# EAGLE design wbz451pe (EAGLE 9.6.2)
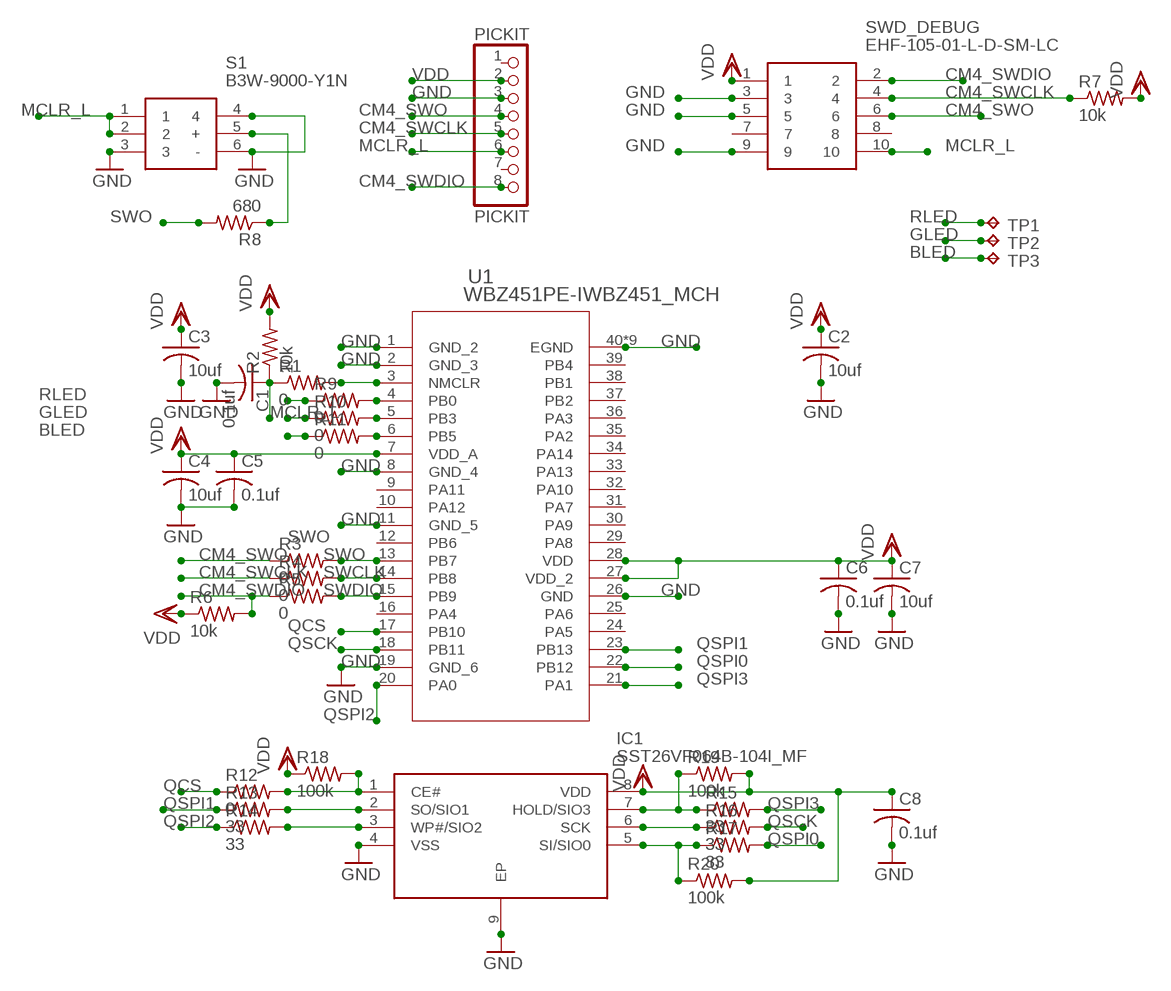
[diagram p0: schematic, sheet 1]

## Parts
C1  0.1uf  C-USC0805  [C0805]
C2  10uf  C-USC0805  [C0805]
C3  10uf  C-USC0805  [C0805]
C4  10uf  C-USC0805  [C0805]
C5  0.1uf  C-USC0805  [C0805]
C6  0.1uf  C-USC0805  [C0805]
C7  10uf  C-USC0805  [C0805]
C8  0.1uf  C-USC0805  [C0805]
IC1  SST26VF064B-104I_MF  [SON127P600X500X80-9N]
PICKIT  PICKIT  PINHD-1X8  [1X08]
R1  0  R-US_M0805  [M0805]
R2  10k  R-US_M0805  [M0805]
R3  0  R-US_M0805  [M0805]
R4  0  R-US_M0805  [M0805]
R5  0  R-US_M0805  [M0805]
R6  10k  R-US_M0805  [M0805]
R7  10k  R-US_M0805  [M0805]
R8  680  R-US_M0805  [M0805]
R9  0  R-US_M0805  [M0805]
R10  0  R-US_M0805  [M0805]
R11  0  R-US_M0805  [M0805]
R12  0  R-US_R0603  [R0603]
R13  33  R-US_R0603  [R0603]
R14  33  R-US_R0603  [R0603]
R15  33  R-US_R0603  [R0603]
R16  33  R-US_R0603  [R0603]
R17  33  R-US_R0603  [R0603]
R18  100k  R-US_R0603  [R0603]
R19  100k  R-US_R0603  [R0603]
R20  100k  R-US_R0603  [R0603]
S1  B3W-9000-Y1N  [B3W-9_1-LED]
SWD_DEBUG  EHF-105-01-L-D-SM-LC  [EHF-105-01-XX-D-SM-LC]
TP1  TPPAD1-13  [P1-13]
TP2  TPPAD1-13  [P1-13]
TP3  TPPAD1-13  [P1-13]
U1  WBZ451PE-IWBZ451_MCH  [WBZ451_MCH]

## Nets
BLED: R11.1 TP3.TP
CM4_SWCLK: PICKIT.5 R4.1 R7.1 SWD_DEBUG.4
CM4_SWDIO: PICKIT.8 R5.1 R6.2 SWD_DEBUG.2
CM4_SWO: PICKIT.4 R3.1 SWD_DEBUG.6
GLED: R10.1 TP2.TP
GND: C1.2 C2.2 C3.2 C4.2 C5.2 C6.2 C7.2 C8.2 IC1.4(VSS) IC1.9(EP) PICKIT.3 S1.3 S1.4 S1.6(-) SWD_DEBUG.3 SWD_DEBUG.5 SWD_DEBUG.9 U1.1(GND_2) U1.2(GND_3) U1.8(GND_4) U1.11(GND_5) U1.19(GND_6) U1.26(GND) U1.40(EGND) U1.41(EGND) U1.42(EGND) U1.43(EGND) U1.44(EGND) U1.45(EGND) U1.46(EGND) U1.47(EGND) U1.48(EGND)
MCLR_L: C1.1 PICKIT.6 R1.1 R2.1 S1.1 S1.2 SWD_DEBUG.10
N$1: R1.2 U1.3(NMCLR)
N$2: R9.2 U1.4(PB0)
N$3: R8.1 S1.5(+)
N$4: R10.2 U1.5(PB3)
N$5: R11.2 U1.6(PB5)
N$6: IC1.1(CE#) R12.2 R18.2
N$7: IC1.2(SO/SIO1) R13.2
N$8: IC1.3(WP#/SIO2) R14.2
N$9: IC1.7(HOLD/SIO3) R15.1 R19.1
N$10: IC1.6(SCK) R16.1
N$11: IC1.5(SI/SIO0) R17.1 R20.1
QCS: R12.1 U1.17(PB10)
QSCK: R16.2 U1.18(PB11)
QSPI0: R17.2 U1.22(PB12)
QSPI1: R13.1 U1.23(PB13)
QSPI2: R14.1 U1.20(PA0)
QSPI3: R15.2 U1.21(PA1)
RLED: R9.1 TP1.TP
SWCLK: R4.2 U1.14(PB8)
SWDIO: R5.2 U1.15(PB9)
SWO: R3.2 R8.2 U1.13(PB7)
VDD: C2.1 C3.1 C4.1 C5.1 C6.1 C7.1 C8.1 IC1.8(VDD) PICKIT.2 R2.2 R6.1 R7.2 R18.1 R19.2 R20.2 SWD_DEBUG.1 U1.7(VDD_A) U1.27(VDD_2) U1.28(VDD)
Unconnected: PICKIT.1 PICKIT.7 SWD_DEBUG.7 SWD_DEBUG.8 U1.9(PA11) U1.10(PA12) U1.12(PB6) U1.16(PA4) U1.24(PA5) U1.25(PA6) U1.29(PA8) U1.30(PA9) U1.31(PA7) U1.32(PA10) U1.33(PA13) U1.34(PA14) U1.35(PA2) U1.36(PA3) U1.37(PB2) U1.38(PB1) U1.39(PB4)

## Library data of the parts
C1-C8 = rcl:C-US: CAPACITOR, American symbol; SPICEPREFIX: C
IC1 = SST26VF064B-104I_MF:SST26VF064B-104I_MF: SST26VF064B-104I/MF, SPI Split Gate Flash Memory, 8M x 8 bit 64Mbit, 3ns, 2.7 3.6 V, 8-Pin, WDFN Source: Datasheet <http://www.microchip.com/mymicrochip/filehandler.aspx?ddocname=en561262>; DESCRIPTION: SST26VF064B-104I/MF, SPI Split Gate Flash Memory, 8M x 8 bit 64Mbit, 3ns, 2.7 3.6 V, 8-Pin, WDFN; HEIGHT: 0.8mm; MANUFACTURER_NAME: Microchip; MANUFACTURER_PART_NUMBER: SST26VF064B-104I/MF; MOUSER_PART_NUMBER: 579-ST26VF064B104IMF; MOUSER_PRICE-STOCK: https://www.mouser.co.uk/ProductDetail/Microchip-Technology-Atmel/SST26VF064B-104I-MF?qs=wzzOUr4NhYqR1%252B6K2JaweQ%3D%3D
PICKIT = pinhead:PINHD-1X8: PIN HEADER
R1-R20 = rcl:R-US_: RESISTOR, American symbol; SPICEPREFIX: R
S1 = SamacSys_Parts:B3W-9000-Y1N: Illuminated Tactile Switches Illuminated Ylw LED White Cap Source: Datasheet <http://www.mouser.com/ds/2/307/en-b3w-9-11824.pdf>; ALLIED_NUMBER: 70176005; ALLIED_PRICE-STOCK: https://www.alliedelec.com/omron-electronic-components-b3w-9000-y1n/70176005/; DESCRIPTION: Illuminated Tactile Switches Illuminated Ylw LED White Cap; HEIGHT: mm; MANUFACTURER_NAME: Omron Electronics; MANUFACTURER_PART_NUMBER: B3W-9000-Y1N; MOUSER_PART_NUMBER: 653-B3W-9000-Y1N; MOUSER_PRICE-STOCK: https://www.mouser.com/Search/Refine.aspx?Keyword=653-B3W-9000-Y1N; RS_PART_NUMBER: 0492777P; RS_PRICE-STOCK: http://uk.rs-online.com/web/p/products/0492777P
SWD_DEBUG = EHF-105-01-L-D-SM-LC:EHF-105-01-L-D-SM-LC: 10 Position, .050" Shrouded IDC Header with Ejectors Source: Datasheet <http://suddendocs.samtec.com/prints/ehf-1xx-01-x-d-xx-xx-xx-mkt.pdf>; DESCRIPTION: 10 Position, .050&quot; Shrouded IDC Header with Ejectors; HEIGHT: mm; MANUFACTURER_NAME: SAMTEC; MANUFACTURER_PART_NUMBER: EHF-105-01-L-D-SM-LC; MOUSER_PART_NUMBER: 200-EHF10501LDSMLC; MOUSER_PRICE-STOCK: https://www.mouser.co.uk/ProductDetail/Samtec/EHF-105-01-L-D-SM-LC?qs=iT52DjcXudvuSMtK3643sA%3D%3D
TP1-TP3 = testpad:TP: Test pad
U1 = 2024-05-29_22-27-45_Library:WBZ451PE-I; COPYRIGHT: Copyright (C) 2024 Ultra Librarian. All rights reserved.; MANUFACTURER_PART_NUMBER: WBZ451PE-I; MFR_NAME: Microchip

## Board
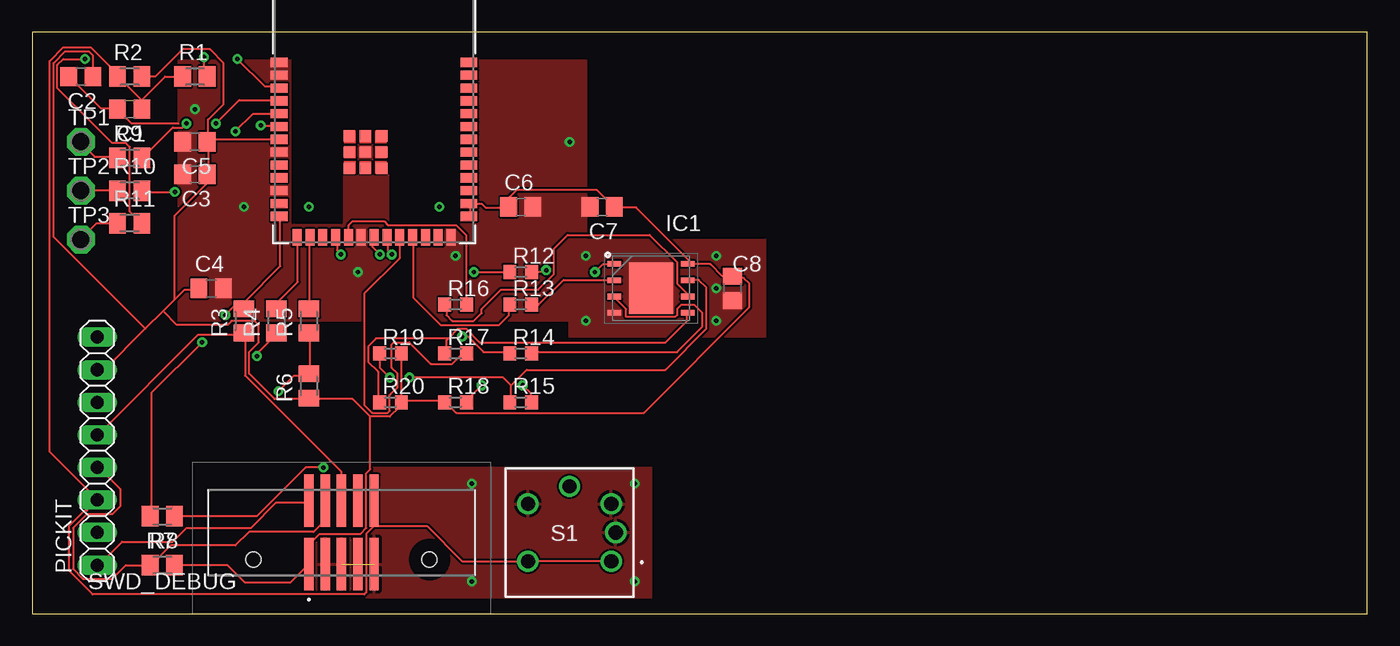
[diagram p1: board, top side]
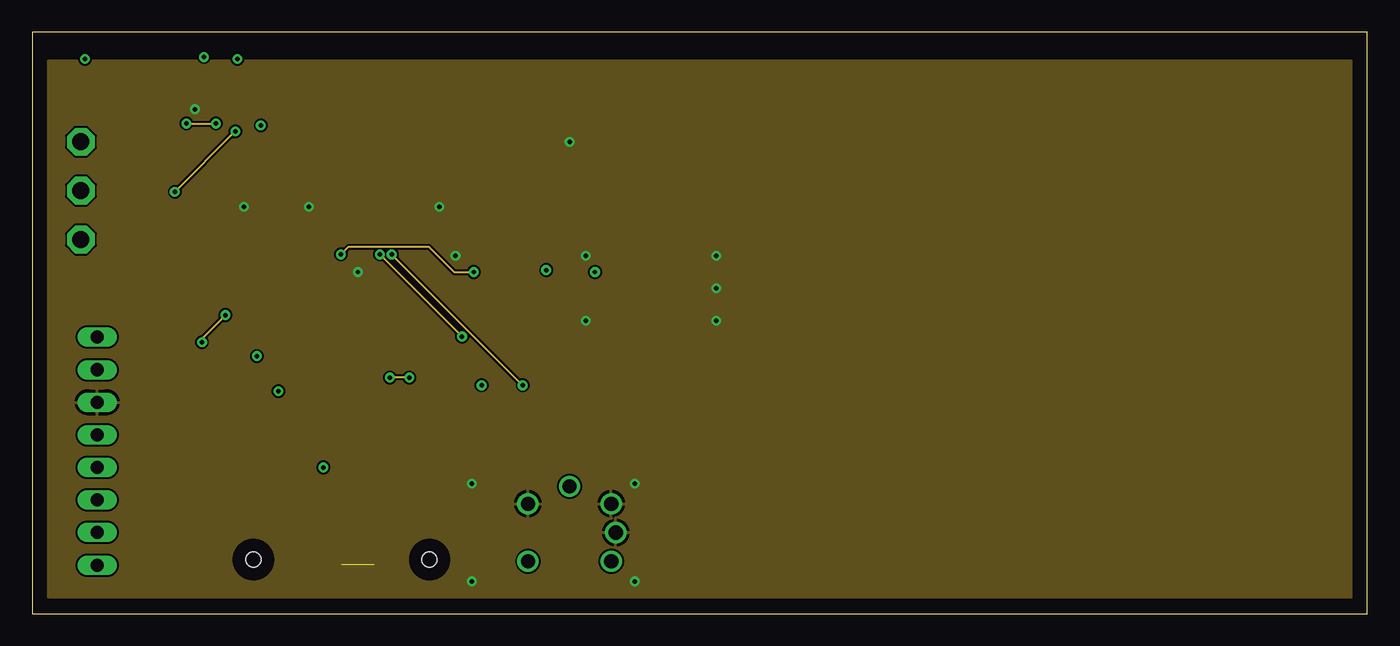
[diagram p2: board, inner layer Route2]
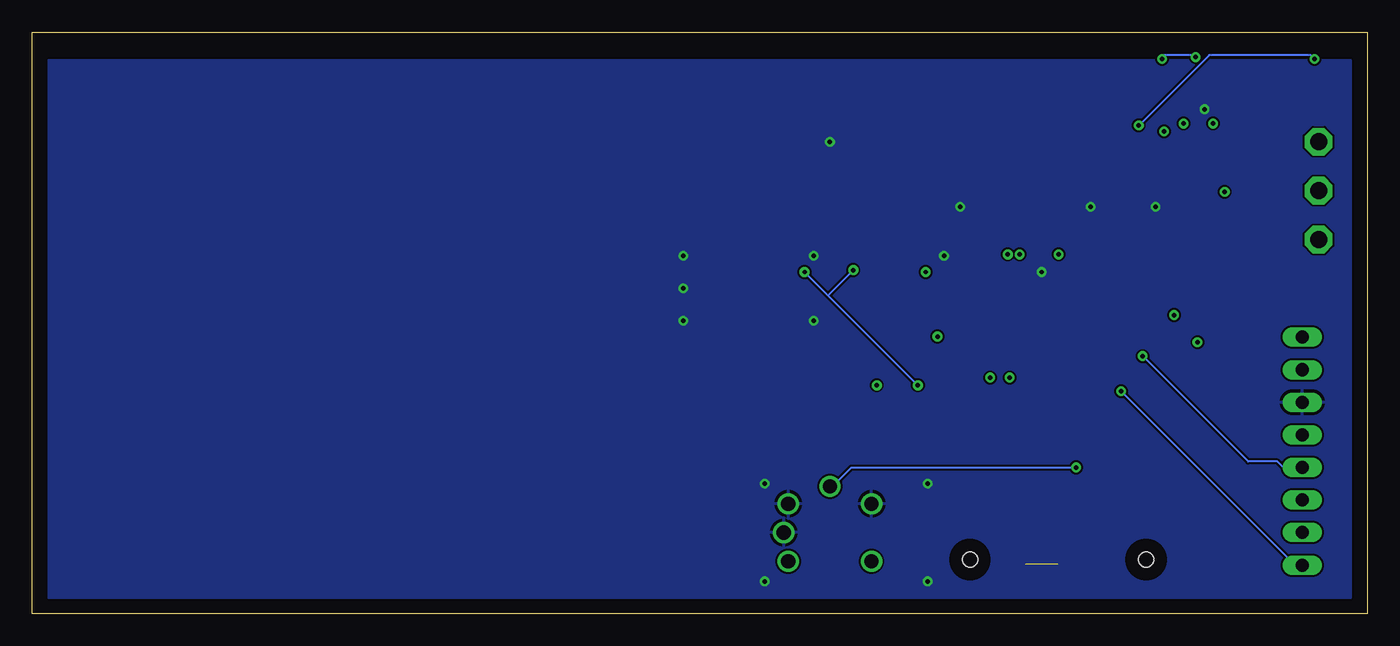
[diagram p3: board, bottom side, seen from below]

Size 104.12 x 45.39 mm. Coordinates in mm from the lower left corner, seen from the top.
Outline: 0,0 104.12,0 104.12,45.39 0,45.39 0,0
Copper layers (1+2*15+16): Top 0.035mm / dielectric 1.5mm / Route2 0.035mm / dielectric 0.15mm / Route15 0.035mm / dielectric 0.2mm / Bottom 0.035mm
Design rules "default *": minimum track width 6mil, minimum drill 0.35mm, track to track 6mil, track to pad 6mil, pad to pad 6mil, via to via 6mil, smd to smd 6mil, copper to edge 40mil, drill to drill 6mil, minimum pad ring 10mil, minimum via ring 8mil, stop-mask expansion 4mil, vias tented up to drill 0mil, thermal gap 10mil
tRestrict: area 27.9,30.5 to 33,44.5; area 20.3,30.5 to 24.1,44.5

### Footprints (pad centres in the part's own frame; a part is rotated, then mirrored left to right if it is on the bottom)
C0805 = smd 1.3 x 1.5: 1 -0.95,0; 2 0.95,0
SON127P600X500X80-9N = smd 1.05 x 0.45: 1 -2.85,1.905; 2 -2.85,0.635; 3 -2.85,-0.635; 4 -2.85,-1.905; 5 2.85,-1.905; 6 2.85,-0.635; 7 2.85,0.635; 8 2.85,1.905 | smd 3.4 x 4: 9 0,0
1X08 = drill 1.016 long: 1 -8.89,0; 2 -6.35,0; 3 -3.81,0; 4 -1.27,0; 5 1.27,0; 6 3.81,0; 7 6.35,0; 8 8.89,0
M0805 = smd 1.3 x 1.6: 1 -0.95,0; 2 0.95,0
R0603 = smd 1 x 1.1: 1 -0.85,0; 2 0.85,0
B3W-9_1-LED = drill 1.1 pad 1.65: 1 3.25,-2.25; 2 -3.25,-2.25; 3 3.25,2.25; 4 -3.25,2.25; 5 0,3.6; 6 3.6,0
EHF-105-01-XX-D-SM-LC = smd 0.74 x 4.09: 1 -2.54,-2.475; 2 -2.54,2.475; 3 -1.27,-2.475; 4 -1.27,2.475; 5 0,-2.475; 6 0,2.475; 7 1.27,-2.475; 8 1.27,2.475; 9 2.54,-2.475; 10 2.54,2.475 | hole 1.19: -6.86,-2.11; 6.86,-2.11
P1-13 = drill 1.321 pad 2.159 octagon: TP 0,0
WBZ451_MCH = smd 1.295 x 0.711: 1 -7.4,3.65; 2 -7.4,2.65; 3 -7.4,1.65; 4 -7.4,0.65; 5 -7.4,-0.35; 6 -7.4,-1.35; 7 -7.4,-2.35; 8 -7.4,-3.35; 9 -7.4,-4.35; 10 -7.4,-5.35; 11 -7.4,-6.35; 12 -7.4,-7.35; 13 -7.4,-8.35; 27 7.4,-8.35; 28 7.4,-7.35; 29 7.4,-6.35; 30 7.4,-5.35; 31 7.4,-4.35; 32 7.4,-3.35; 33 7.4,-2.35; 34 7.4,-1.35; 35 7.4,-0.35; 36 7.4,0.65; 37 7.4,1.65; 38 7.4,2.65; 39 7.4,3.65 | smd 0.711 x 1.295: 14 -6,-10; 15 -5,-10; 16 -4,-10; 17 -3,-10; 18 -2,-10; 19 -1,-10; 20 0,-10; 21 1,-10; 22 2,-10; 23 3,-10; 24 4,-10; 25 5,-10; 26 6,-10 | smd 0.889 x 0.889: 40 -0.68,-3.35; 41 -1.95,-2.08; 42 -0.68,-2.08; 43 0.59,-2.08; 44 0.59,-3.35; 45 0.59,-4.62; 46 -0.68,-4.62; 47 -1.95,-3.35; 48 -1.95,-4.62

### Placement (x,y rotation side)
C1  7.62,39.37 180 top
C2  3.81,41.91 180 top
C3  12.7,34.29 180 top
C4  13.97,25.4 0 top
C5  12.7,36.83 180 top
C6  38.1,31.75 0 top
C7  44.45,31.75 180 top
C8  54.61,25.4 270 top
IC1  48.26,25.4 0 top
PICKIT  5.08,12.7 270 top
R1  12.7,41.91 0 top
R2  7.62,41.91 0 top
R3  16.51,22.86 90 top
R4  19.05,22.86 90 top
R5  21.59,22.86 90 top
R6  21.59,17.78 90 top
R7  10.16,3.81 0 top
R8  10.16,7.62 180 top
R9  7.62,35.56 0 top
R10  7.62,33.02 0 top
R11  7.62,30.48 0 top
R12  38.1,26.67 0 top
R13  38.1,24.13 0 top
R14  38.1,20.32 0 top
R15  38.1,16.51 0 top
R16  33.02,24.13 0 top
R17  33.02,20.32 0 top
R18  33.02,16.51 0 top
R19  27.94,20.32 0 top
R20  27.94,16.51 0 top
S1  41.91,6.35 0 top
SWD_DEBUG  24.13,6.35 0 top
TP1  3.81,36.83 0 top
TP2  3.81,33.02 0 top
TP3  3.81,29.21 0 top
U1  26.67,39.37 0 top

### Tracks (layer width: path | path; a pad name or v marks a point on that pad's centre or on a via)
BLED
  Top 0.152: R11.1 5.03,30.48 3.81,29.26 TP3.TP
CM4_SWCLK  (via drill 0.35)
  Top 0.152: SWD_DEBUG.4 22.86,7.32 21.95,6.4 16.92,6.4 15.85,5.33 10.82,5.33 9.3,3.81 R7.1 7.32,3.81 6.25,2.74 3.96,2.74 3.2,3.5 3.2,6.71 4.27,7.77 6.25,7.77 6.86,8.38 6.86,9.75 5.18,11.43 PICKIT.5 | v17.53,20.12 17.53,20.27 19.05,21.79 R4.1
  Bottom 0.152: v17.53,20.12 9.3,11.89 7.01,11.89 6.55,11.43 PICKIT.5
CM4_SWDIO  (via drill 0.35)
  Top 0.152: R5.1 21.64,21.79 21.64,18.75 R6.2 21.49,18.59 20.42,18.59 v19.2,17.37 | SWD_DEBUG.2 21.49,8.69 19.05,8.69 17.07,6.71 12.04,6.71 10.97,5.64 7.01,5.64 5.18,3.81 PICKIT.8
  Bottom 0.152: v19.2,17.37 5.64,3.81 PICKIT.8
CM4_SWO
  Top 0.152: PICKIT.4 5.18,14.02 12.95,21.79 16.46,21.79 R3.1 16.61,21.79 16.61,18.59 24.08,11.12 24.08,8.84 SWD_DEBUG.6
GLED
  Top 0.152: R10.1 6.55,33.07 3.81,33.07 TP2.TP
GND  (via drill 0.35)  (1 unrouted)
  Top 0.152: C2.2 2.9,41.91 5.33,39.47 6.55,39.47 C1.2 6.71,39.32 7.77,38.25 11.43,38.25
  other vias: 31.75,31.75 21.59,31.75 41.91,36.83 25.4,26.67 34.29,10.16 34.29,2.54 46.99,10.16 46.99,2.54 53.34,27.94 53.34,22.86 43.18,27.94 43.18,22.86 53.34,25.4 33.02,27.94 16.51,31.75 12.7,39.37
  pour Top (no thermals): 11.43,43.18 43.18,43.18 43.18,22.86 12.7,22.86 11.43,22.86
  pour Route2: 1.27,43.18 102.87,43.18 102.87,1.27 1.27,1.27
  pour Bottom: 1.27,43.18 102.87,43.18 102.87,1.27 1.27,1.27
  pour Top: 12.7,11.43 48.26,11.43 48.26,1.27 12.7,1.27
  pour Top (no thermals): 41.91,29.21 57.15,29.21 57.15,21.59 41.91,21.59
MCLR_L
  Top 0.152: S1.1 45.11,4.12 38.71,4.12 S1.2 38.56,4.12 33.53,4.12 30.79,6.86 26.67,6.86 | 8.53,40.08 8.53,39.47 C1.1 8.53,40.08 | 8.53,40.08 6.71,41.91 R2.1 6.55,41.91 6.55,42.22 4.57,44.2 2.44,44.2 1.37,43.13 1.37,12.65 5.03,8.99 PICKIT.6 4.27,8.08 4.12,8.08 2.9,6.86 2.9,3.35 4.72,1.52 25.91,1.52 26.06,1.68 26.06,6.25 26.67,6.86 | R1.1 10.36,41.91 8.53,40.08 | SWD_DEBUG.10 26.67,6.86
N$1  (via drill 0.35)
  Top 0.152: v16,43.28 18.14,41.15 19.2,41.15 U1.3 | v13.41,43.43 13.41,42.06 13.56,41.91 R1.2
  Bottom 0.152: v16,43.28 16,43.43 15.85,43.59 13.56,43.59 v13.41,43.43
N$2  (via drill 0.35)
  Top 0.152: v14.33,38.25 16.15,40.08 19.2,40.08 U1.4 | v12.04,38.25 11.73,37.95 10.97,37.95 8.69,35.66 R9.2
  Route2 0.152: v12.04,38.25 v14.33,38.25
N$3  (via drill 0.35)
  Top 0.152: R8.1 17.53,7.62 21.34,11.43 v22.71,11.43
  Bottom 0.152: v22.71,11.43 40.23,11.43 41.6,10.06 41.91,10.06 S1.5
N$4  (via drill 0.35)
  Top 0.152: v15.85,37.64 17.22,39.01 19.2,39.01 U1.5 | v11.12,32.92 8.69,32.92 R10.2
  Route2 0.152: v11.12,32.92 v15.85,37.64
N$5  (via drill 0.35)
  Top 0.152: v17.83,38.1 19.2,38.1 U1.6 | v4.12,43.28 2.44,43.28 1.98,42.82 1.98,41 6.25,36.73 7.32,36.73 7.62,36.42 7.62,31.39 8.53,30.48 R11.2
  Bottom 0.152: v17.83,38.1 12.34,43.59 4.42,43.59 v4.12,43.28
N$6  (via drill 0.35)
  Top 0.152: v43.89,26.67 44.5,27.28 45.26,27.28 IC1.1 | v35.05,17.83 33.83,16.61 R18.2 | R12.2 39.93,26.67 v40.08,26.82
  Bottom 0.152: v35.05,17.83 42.06,24.84 | 42.06,24.84 v43.89,26.67 | 42.06,24.84 v40.08,26.82
N$7
  Top 0.152: IC1.2 45.26,26.06 41.45,26.06 39.47,24.08 39.01,24.08 R13.2
N$8
  Top 0.152: IC1.3 45.41,24.69 46.33,23.77 46.33,23.16 50.14,23.16 50.29,23.32 50.29,23.77 50.6,24.08 51.66,24.08 52.27,23.47 52.27,22.4 50.29,20.42 39.01,20.42 R14.2
N$9  (via drill 0.35)
  Top 0.152: 37.34,17.83 38.56,19.05 49.38,19.05 52.58,22.25 52.58,25.45 51.97,26.06 51.21,26.06 IC1.7 | 37.34,17.83 37.34,16.61 R15.1 | v27.89,18.44 27.13,19.2 27.13,20.27 R19.1 | v29.41,18.44 36.73,18.44 37.34,17.83
  Route2 0.152: v29.41,18.44 v27.89,18.44
N$10
  Top 0.152: IC1.6 51.05,24.84 51.05,24.99 50.29,25.76 50.29,27.43 48.16,29.57 41.76,29.57 40.69,28.5 40.69,26.52 39.47,25.3 36.58,25.3 35.05,23.77 35.05,23.47 34.44,22.86 32.77,22.86 32.31,23.32 32.31,24.08 R16.1
N$11
  Top 0.152: 32.46,21.49 32.31,21.34 32.31,20.42 R17.1 | 32.46,21.49 33.22,22.25 33.83,22.25 34.9,21.18 49.38,21.18 51.05,22.86 51.05,23.47 IC1.5 | 32.46,21.49 26.82,21.49 26.21,20.88 26.21,19.66 26.98,18.9 26.98,16.61 R20.1
QCS  (via drill 0.35)
  Top 0.152: v34.44,26.67 R12.1 | v24.08,28.04 23.77,28.35 23.77,29.26 U1.17
  Route2 0.152: v34.44,26.67 32.92,26.67 30.94,28.65 24.69,28.65 v24.08,28.04
QSCK
  Top 0.152: R16.2 33.83,24.23 33.83,29.57 33.07,30.33 27.74,30.33 27.43,30.63 24.99,30.63 24.69,30.33 24.69,29.41 U1.18
QSPI0
  Top 0.152: R17.2 33.83,20.27 33.53,20.27 32.77,19.51 31.09,19.51 29.41,21.18 28.19,21.18 28.04,21.03 28.04,19.2 28.5,18.75 28.5,17.68 27.89,17.07 27.89,15.85 27.74,15.7 26.52,15.7 25.91,16.31 25.91,24.99 28.65,27.74 28.65,29.26 U1.22
QSPI1
  Top 0.152: R13.1 37.19,24.08 37.19,23.32 36.42,22.55 31.85,22.55 29.72,24.69 29.72,29.26 U1.23
QSPI2  (via drill 0.35)
  Top 0.152: v33.53,21.64 33.98,21.64 35.2,20.42 37.19,20.42 R14.1 | v27.13,28.04 26.52,28.65 26.52,29.11 26.67,29.26 U1.20
  Route2 0.152: v27.13,28.04 v33.53,21.64
QSPI3  (via drill 0.35)
  Top 0.152: v38.25,17.83 38.86,17.22 38.86,16.61 R15.2 | v28.04,28.04 27.74,28.35 27.74,29.26 U1.21
  Route2 0.152: v28.04,28.04 v38.25,17.83
RLED
  Top 0.152: R9.1 6.55,35.66 4.88,35.66 3.81,36.73 TP1.TP
SWCLK
  Top 0.152: R4.2 19.05,24.23 20.73,25.91 20.73,29.26 U1.14
SWDIO
  Top 0.152: U1.15 21.64,29.26 21.64,23.93 R5.2
SWO  (via drill 0.35)
  Top 0.152: U1.13 19.36,30.94 19.36,27.13 16.61,24.38 16.61,23.93 R3.2 16.46,23.93 15.7,23.93 v15.09,23.32 | v13.26,21.18 9.3,17.22 9.3,7.62 R8.2
  Route2 0.152: v13.26,21.18 13.26,21.49 v15.09,23.32
VDD
  Top 0.152: 13.72,36.88 13.87,37.03 19.2,37.03 U1.7 | R2.2 9.6,41.91 11.73,44.04 13.87,44.04 14.94,42.98 14.94,39.78 13.72,38.56 13.72,36.88 | 13.72,36.88 C5.1 13.72,36.73 13.72,34.29 C3.1 13.56,34.29 13.56,33.53 11.12,31.09 11.12,24.54 | 8.84,22.25 5.64,19.05 PICKIT.2 | 8.84,22.25 10.21,23.62 | 10.21,23.62 11.12,24.54 | 11.12,24.54 11.89,25.3 12.95,25.3 C4.1 | 8.84,22.25 1.68,29.41 1.68,42.98 2.59,43.89 4.42,43.89 4.72,43.59 4.72,41.91 C2.1 | 34.14,32 34.14,31.09 U1.27 | 34.14,32 35.05,32 35.36,31.7 37.03,31.7 C6.1 37.19,31.85 37.19,32.46 37.8,33.07 44.04,33.07 45.26,31.85 C7.1 45.41,31.7 47.09,31.7 51.51,27.28 | 34.14,32 U1.28 | 51.51,27.28 52.88,27.28 53.8,26.36 54.56,26.36 C8.1 54.71,26.21 55.47,26.21 55.93,25.76 55.93,23.93 47.7,15.7 33.07,15.7 32.31,16.46 R18.1 32.16,16.61 28.8,16.61 | 51.51,27.28 51.21,27.28 IC1.8 51.51,27.28 | 28.8,16.61 28.8,20.27 R19.2 | 28.8,16.61 R20.2 28.65,16.46 28.65,16.15 27.89,15.39 26.36,15.39 | 26.36,15.39 24.99,16.76 21.64,16.76 R6.1 21.49,16.76 18.9,16.76 16.92,18.75 16.92,20.42 17.68,21.18 17.68,22.55 17.37,22.86 15.54,22.86 15.24,22.55 11.28,22.55 10.21,23.62 | R7.2 15.24,3.81 16.61,2.44 20.12,2.44 21.49,3.81 SWD_DEBUG.1 21.64,3.96 21.64,5.49 22.4,6.25 25.6,6.25 26.06,6.71 26.06,10.97 26.36,11.28 26.36,15.39